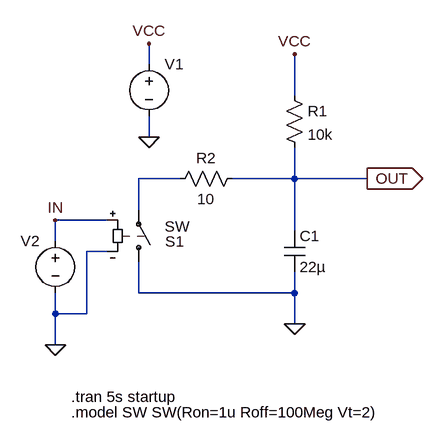
[diagram p0: schematic v1.0.asc]
v1.0.asc, the LTspice schematic file:
Version 4.1
SHEET 1 1260 848
WIRE 528 16 528 -16
WIRE 752 64 752 0
WIRE 528 128 528 96
WIRE 576 192 512 192
WIRE 752 192 752 144
WIRE 752 192 656 192
WIRE 864 192 752 192
WIRE 512 240 512 192
WIRE 464 256 384 256
WIRE 752 272 752 192
WIRE 384 288 384 256
WIRE 464 304 432 304
WIRE 512 368 512 320
WIRE 752 368 752 336
WIRE 752 368 512 368
WIRE 384 400 384 368
WIRE 432 400 432 304
WIRE 432 400 384 400
WIRE 752 416 752 368
WIRE 384 448 384 400
FLAG 528 128 0
FLAG 864 192 OUT
IOPIN 864 192 Out
FLAG 384 256 IN
FLAG 384 448 0
FLAG 528 -16 VCC
FLAG 752 0 VCC
FLAG 752 416 0
SYMBOL sw 512 336 M180
WINDOW 0 41 47 Left 2
WINDOW 3 40 70 Left 2
SYMATTR InstName S1
SYMBOL res 736 48 R0
SYMATTR InstName R1
SYMATTR Value 10k
SYMBOL voltage 528 0 R0
WINDOW 123 0 0 Left 0
WINDOW 39 0 0 Left 0
WINDOW 3 41 64 Invisible 2
SYMATTR Value PULSE(0 3.3 1 1n 1n 4 4 1)
SYMATTR InstName V1
SYMBOL voltage 384 272 M0
WINDOW 3 41 64 Invisible 2
WINDOW 123 0 0 Left 0
WINDOW 39 39 69 Left 2
SYMATTR Value PULSE(0 3.3 3 1n 1n 50m 80m 1)
SYMATTR InstName V2
SYMBOL cap 736 272 R0
SYMATTR InstName C1
SYMATTR Value 22µ
SYMATTR SpiceLine Rser=0.05
SYMBOL res 672 176 R90
WINDOW 0 0 56 VBottom 2
WINDOW 3 32 56 VTop 2
SYMATTR InstName R2
SYMATTR Value 10
TEXT 408 528 Left 2 !.tran 5s startup
TEXT 408 552 Left 2 !.model SW SW(Ron=1u Roff=100Meg Vt=2)

The netlist it stands for:
* v1.0.asc
S1 0 N001 IN 0 SW
R1 VCC OUT 10k
V1 VCC 0 PULSE(0 3.3 1 1n 1n 4 4 1)
V2 IN 0 PULSE(0 3.3 3 1n 1n 50m 80m 1)
C1 OUT 0 22µ Rser=0.05
R2 OUT N001 10
.tran 5s startup
.model SW SW(Ron=1u Roff=100Meg Vt=2)
.backanno
.end